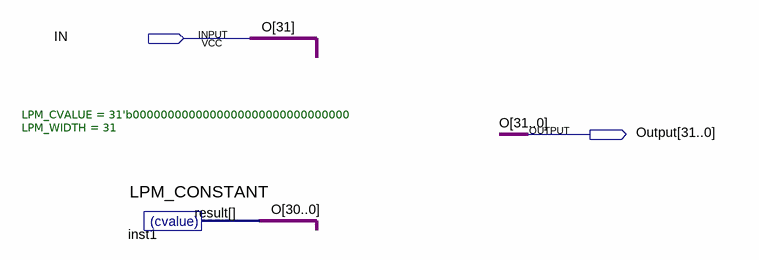
[diagram p0: schematic sheet]
// Quartus schematic zeroextend.bdf as structural Verilog: 1 symbols, 2 pins
module zeroextend (
  input  IN,
  output [31:0] Output
);

  LPM_CONSTANT #(.LPM_CVALUE(31'b0000000000000000000000000000000), .LPM_WIDTH(31)) inst1 (.result(Output[30:0]));

  assign Output[31] = IN;

  // Other names for the same wires on the sheet: O[31:0] = {IN, Output[30:0]}
endmodule
